# Altium project Adapter_USB3_to_M2_E.PrjPcb
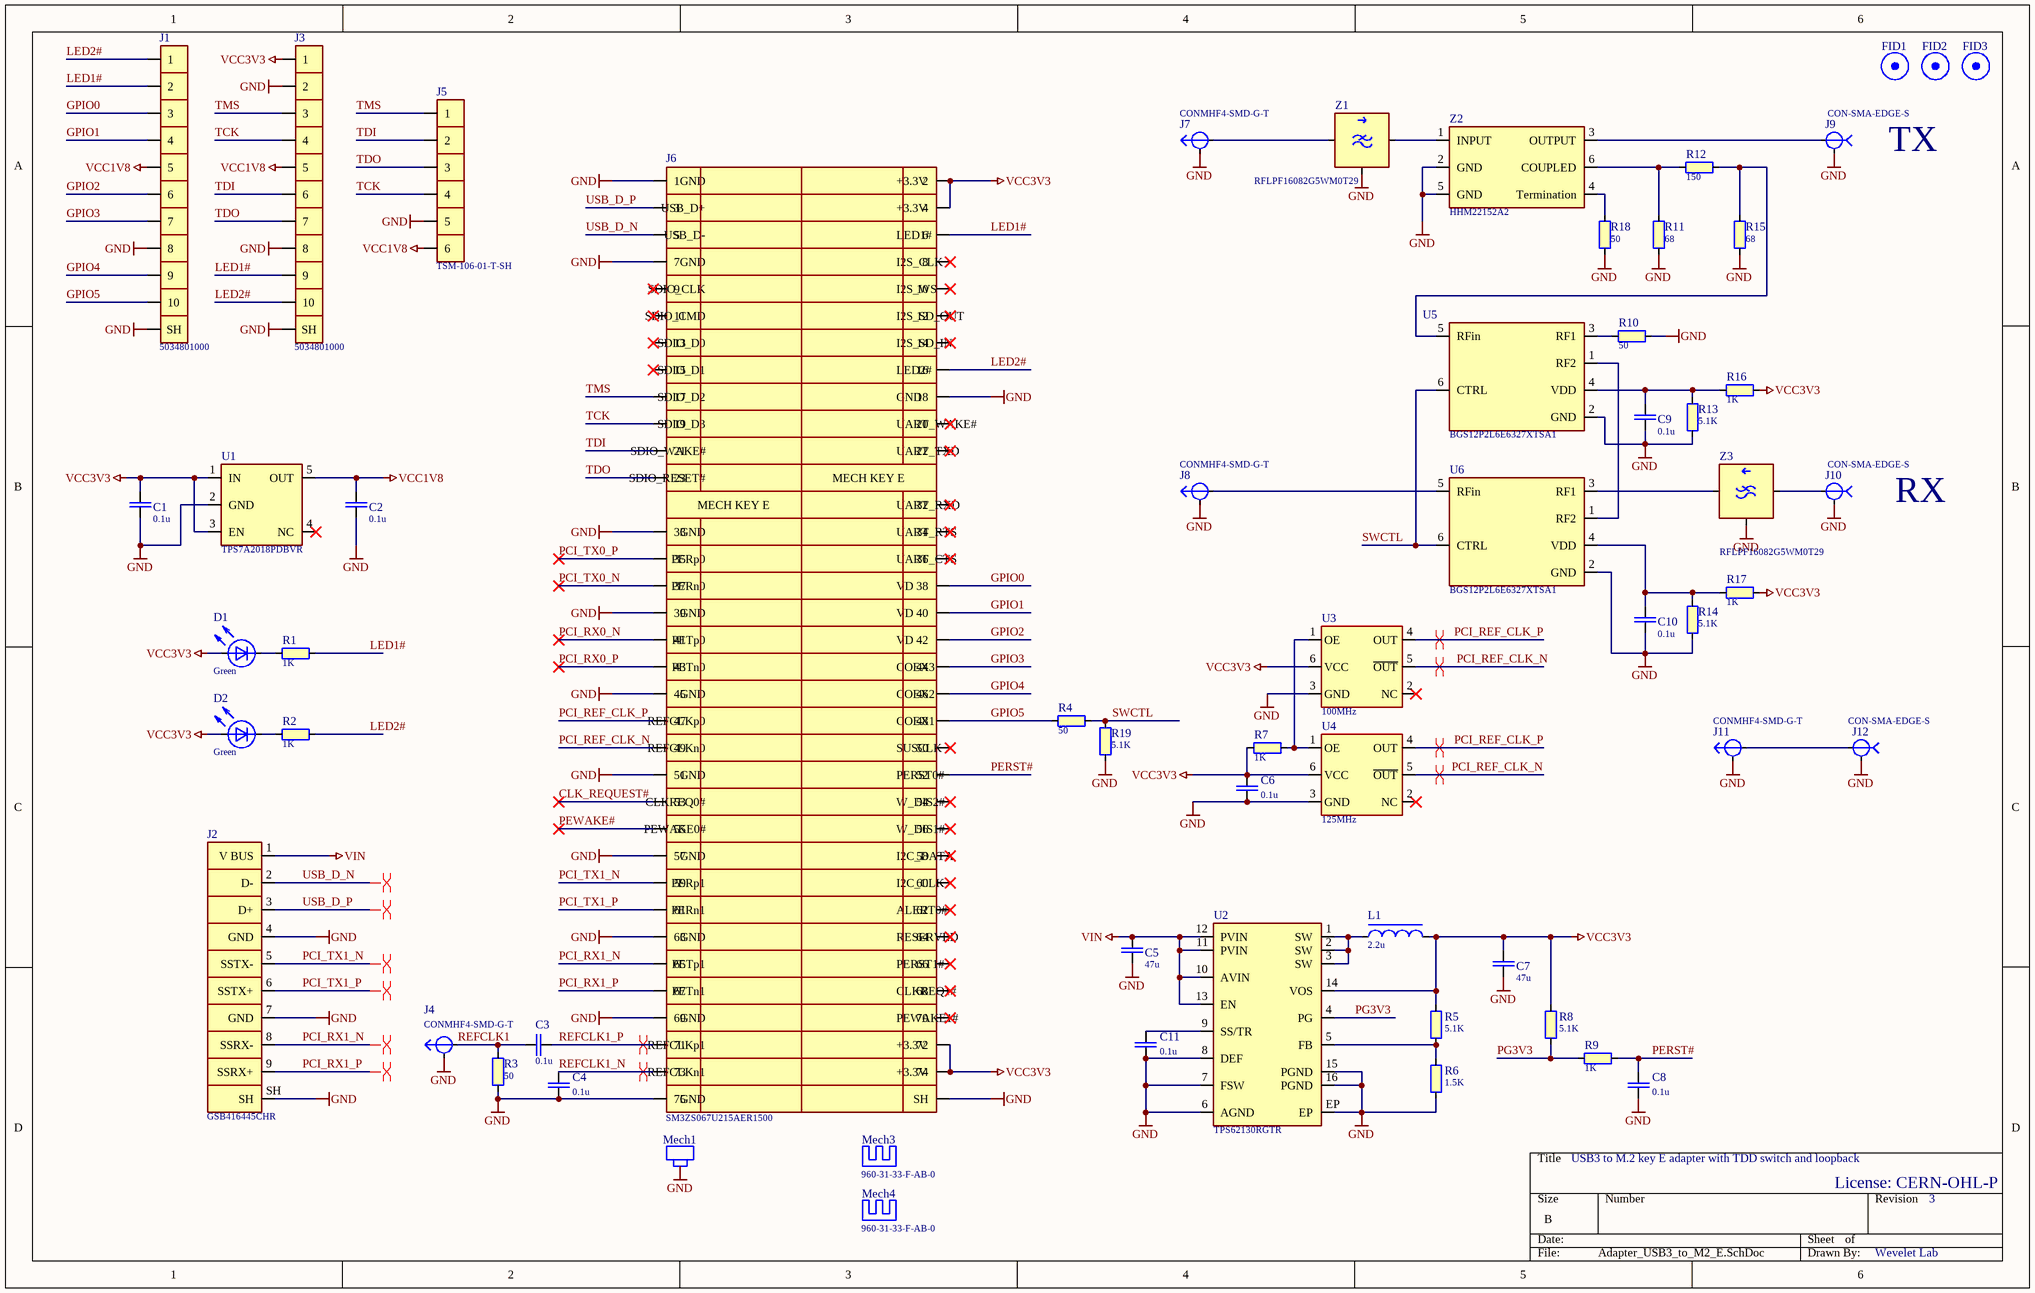
[diagram p0: Adapter_USB3_to_M2_E.SchDoc]
Revision: REV.0
1 sheet, 60 parts. Net scope: global (net labels, ports and power ports of the same name join across sheets).
Board file: Adapter_USB3_to_M2_E.PcbDoc

## Sheet Adapter_USB3_to_M2_E.SchDoc: USB3 to M.2 key E adapter with TDD switch and loopback
size B

### Parts
C1  value 0.1u  [CAPC100X50X55L25N]  (hidden comment: GRM155R71E104KE14D)
C2  value 0.1u  [CAPC100X50X55L25N]  (hidden comment: GRM155R71E104KE14D)
C3  value 0.1u  [CAPC100X50X55L25N]  (hidden comment: GRM155R71E104KE14D)
C4  value 0.1u  [CAPC100X50X55L25N]  (hidden comment: GRM155R71E104KE14D)
C5  value 47u  [CAPC160X80X100L40N]  (hidden comment: Cap-0603-X5R-6.3V-47u-20%)
C6  value 0.1u  [CAPC100X50X55L25N]  (hidden comment: GRM155R71E104KE14D)  (no BOM)
C7  value 47u  [CAPC160X80X100L40N]  (hidden comment: Cap-0603-X5R-6.3V-47u-20%)
C8  value 0.1u  [CAPC100X50X55L25N]  (hidden comment: GRM155R71E104KE14D)
C9  value 0.1u  [CAPC100X50X55L25N]  (hidden comment: GRM155R71E104KE14D)
C10  value 0.1u  [CAPC100X50X55L25N]  (hidden comment: GRM155R71E104KE14D)
C11  value 0.1u  [CAPC100X50X55L25N]  (hidden comment: GRM155R71E104KE14D)
D1  value Green  [LEDC160X80X80L40N-Green]  (hidden comment: LTST-C190KGKT)
D2  value Green  [LEDC160X80X80L40N-Green]  (hidden comment: LTST-C190KGKT)
FID1  Fiducial  [Fiducial_2D]  (value not drawn)  (no BOM)
FID2  Fiducial  [Fiducial_2D]  (value not drawn)  (no BOM)
FID3  Fiducial  [Fiducial_2D]  (value not drawn)  (no BOM)
J1  5034801000  [MOLEX_5034801000]
J2  GSB416445CHR  [AMPHENOL_GSB416445CHR]
J3  5034801000  [MOLEX_5034801000]
J4  CONMHF4-SMD-G-T  [LINX_CONMHF4-SMD-G-T]
J5  TSM-106-01-T-SH  [SAMTEC_TSM-106-01-T-SH]  (no BOM)
J6  SM3ZS067U215AER1500  [JAE_SM3ZS067U215AER1500]
J7  CONMHF4-SMD-G-T  [LINX_CONMHF4-SMD-G-T]
J8  CONMHF4-SMD-G-T  [LINX_CONMHF4-SMD-G-T]
J9  CON-SMA-EDGE-S  [SSE_S01-SJEDM-11BS00]
J10  CON-SMA-EDGE-S  [SSE_S01-SJEDM-11BS00]
J11  CONMHF4-SMD-G-T  [LINX_CONMHF4-SMD-G-T]
J12  CON-SMA-EDGE-S  [SSE_S01-SJEDM-11BS00]
L1  value 2.2u  [IND_TAIYO_NRS5020]  (hidden comment: NRS5020T2R2NMGJ)
Mech1  SM3ZS067U215-NUT1-R2500  [JAE_SM3ZS067U215-NUT1]  (value not drawn)
Mech3  960-31-33-F-AB-0  [WAKEFIELD_960-31-33-F-AB-0]
Mech4  960-31-33-F-AB-0  [WAKEFIELD_960-31-33-F-AB-0]
R1  value 1K  [RESC100X50X40L20N]  (hidden comment: Res-0402-1K-5%)
R2  value 1K  [RESC100X50X40L20N]  (hidden comment: Res-0402-1K-5%)
R3  value 50  [RESC100X50X40L20N]  (hidden comment: Res-0402-51-5%)
R4  value 50  [RESC100X50X40L20N]  (hidden comment: Res-0402-51-5%)
R5  value 5.1K  [RESC100X50X40L20N]  (hidden comment: Res-0402-5.1K-1%)
R6  value 1.5K  [RESC100X50X40L20N]  (hidden comment: Res-0402-1.5K-1%)
R7  value 1K  [RESC100X50X40L20N]  (hidden comment: Res-0402-1K-5%)  (no BOM)
R8  value 5.1K  [RESC100X50X40L20N]  (hidden comment: Res-0402-5.1K-1%)
R9  value 1K  [RESC100X50X40L20N]  (hidden comment: Res-0402-1K-5%)
R10  value 50  [RESC100X50X40L20N]  (hidden comment: Res-0402-51-5%)
R11  value 68  [RESC100X50X40L20N]  (hidden comment: Res-0402-68-5%)
R12  value 150  [RESC100X50X40L20N]  (hidden comment: Res-0402-150-5%)
R13  value 5.1K  [RESC100X50X40L20N]  (hidden comment: Res-0402-5.1K-1%)
R14  value 5.1K  [RESC100X50X40L20N]  (hidden comment: Res-0402-5.1K-1%)
R15  value 68  [RESC100X50X40L20N]  (hidden comment: Res-0402-68-5%)
R16  value 1K  [RESC100X50X40L20N]  (hidden comment: Res-0402-1K-5%)
R17  value 1K  [RESC100X50X40L20N]  (hidden comment: Res-0402-1K-5%)
R18  value 50  [RESC100X50X40L20N]  (hidden comment: Res-0402-51-5%)
R19  value 5.1K  [RESC100X50X40L20N]  (hidden comment: Res-0402-5.1K-1%)
U1  TPS7A2018PDBVR  [SOT23-5P95_280X145L45X40N]
U2  TPS62130RGTR  [QFN17P50_300X300X100L40X24T170N]
U3  value 100MHz  [ABRACON_AK2A]  (hidden comment: AK2ADDF1-100.000T)  (no BOM)
U4  value 125MHz  [EPCOS_SG3225VAN]  (hidden comment: SG3225VAN 125.000000M-KEGA3)  (no BOM)
U5  BGS12P2L6E6327XTSA1  [PSON6P40_110X70X32L20X20N]
U6  BGS12P2L6E6327XTSA1  [PSON6P40_110X70X32L20X20N]
Z1  RFLPF16082G5WM0T29  [WALSIN_RFLPF16082G5WM0T29]
Z2  HHM22152A2  [TDK_HHM22152A2]
Z3  RFLPF16082G5WM0T29  [WALSIN_RFLPF16082G5WM0T29]

### Nets
GND: C1.1 C2.1 C4.1 C5.2 C6.1 C7.2 C8.1 C9.2 C10.2 C11.1 J1.8 J1.SH J2.4(GND) J2.7(GND) J2.SH J3.2 J3.8 J3.SH J4.SH J5.5 J6.1 J6.7 J6.18 J6.33 J6.39 J6.45 J6.51 J6.57 J6.63 J6.69 J6.75 J6.SH J7.SH J8.SH J9.SH J10.SH J11.SH J12.SH Mech1.SH R3.2 R6.1 R10.2 R11.2 R13.1 R14.1 R15.2 R18.1 R19.1 U1.2(GND) U2.6(AGND) U2.7(FSW) U2.8(DEF) U2.15(PGND) U2.16(PGND) U2.EP U3.3(GND) U4.3(GND) U5.2(GND) U6.2(GND) Z1.2 Z2.2(GND) Z2.5(GND) Z3.2
VCC1V8: C2.2 J1.5 J3.5 J5.6 U1.5(OUT)
VCC3V3: C1.2 C6.2 C7.1 D1.A D2.A J3.1 J6.2 J6.4 J6.72 J6.74 L1.2 R5.2 R7.2 R8.2 R16.2 R17.2 U1.1(IN) U1.3(EN) U2.14(VOS) U3.6(VCC) U4.6(VCC)
VIN: C5.1 J2.1(V_BUS) U2.10(AVIN) U2.11(PVIN) U2.12(PVIN) U2.13(EN)
CLK_REQUEST#: J6.53
GPIO0: J1.3 J6.38
GPIO1: J1.4 J6.40
GPIO2: J1.6 J6.42
GPIO3: J1.7 J6.44
GPIO4: J1.9 J6.46
GPIO5: J1.10 J6.48 R4.1
LED1#: J1.2 J3.9 J6.6 R1.2
LED2#: J1.1 J3.10 J6.16 R2.2
PCI_REF_CLK_N: J6.49 U3.5(~{OUT}) U4.5(~{OUT})
PCI_REF_CLK_P: J6.47 U3.4(OUT) U4.4(OUT)
PCI_RX0_N: J6.41
PCI_RX0_P: J6.43
PCI_RX1_N: J2.8(SSRX-) J6.65
PCI_RX1_P: J2.9(SSRX+) J6.67
PCI_TX0_N: J6.37
PCI_TX0_P: J6.35
PCI_TX1_N: J2.5(SSTX-) J6.59
PCI_TX1_P: J2.6(SSTX+) J6.61
PERST#: C8.2 J6.52 R9.1
PEWAKE#: J6.55
PG3V3: R8.1 R9.2 U2.4(PG)
REFCLK1: C3.1 J4.1 R3.1
REFCLK1_N: C4.2 J6.73
REFCLK1_P: C3.2 J6.71
SWCTL: R4.2 R19.2 U5.6(CTRL) U6.6(CTRL)
TCK: J3.4 J5.4 J6.19
TDI: J3.6 J5.2 J6.21
TDO: J3.7 J5.3 J6.23
TMS: J3.3 J5.1 J6.17
USB_D_N: J2.2(D-) J6.5
USB_D_P: J2.3(D+) J6.3
NetC9_1: C9.1 R13.2 R16.1 U5.4(VDD)
NetC10_1: C10.1 R14.2 R17.1 U6.4(VDD)
NetC11_2: C11.2 U2.9(SS/TR)
NetD1_C: D1.C R1.1
NetD2_C: D2.C R2.1
NetJ7_1: J7.1 Z1.1
NetJ8_1: J8.1 U6.5(RFin)
NetJ9_1: J9.1 Z2.3(OUTPUT)
NetJ10_1: J10.1 Z3.1
NetJ11_1: J11.1 J12.1
NetL1_1: L1.1 U2.1(SW) U2.2(SW) U2.3(SW)
NetR5_1: R5.1 R6.2 U2.5(FB)
NetR7_1: R7.1 U3.1(OE) U4.1(OE)
NetR10_1: R10.1 U5.3(RF1)
NetR11_1: R11.1 R12.2 Z2.6(COUPLED)
NetR12_1: R12.1 R15.1 U5.5(RFin)
NetR18_2: R18.2 Z2.4(Termination)
NetU5_1: U5.1(RF2) U6.1(RF2)
NetU6_3: U6.3(RF1) Z3.3
NetZ1_3: Z1.3 Z2.1(INPUT)

Not connected (* = marked no-connect by the designer): J6 8* 9* 10* 11* 12* 13* 14* 15* 20* 22* 32* 34* 36* 50* 54* 56* 58* 60* 62* 64* 66* 68* 70*; Mech3 MH; Mech4 MH; U1 4(NC)*; U3 2(NC)*; U4 2(NC)*

### Layout directives
differential pair: PCI_REF_CLK_N, PCI_REF_CLK_P, PCI_RX1_N, PCI_RX1_P, PCI_TX1_N, PCI_TX1_P, REFCLK1_N, REFCLK1_P, USB_D_N, USB_D_P

### Notes on the sheet
- TX
- RX
- USB3 to M.2 key E adapter with TDD switch and loopback
- License: CERN-OHL-P
- 3
- Wevelet Lab
- (in symbol SM3ZS067U215AER1500) GND; +3.3V; USB_D+; USB_D-; LED1#; I2S_CLK; SDIO_CLK; I2S_WS; SDIO_CMD; I2S_SD_OUT; SDIO_D0; I2S_SD_IN; SDIO_D1; LED2#; SDIO_D2; SDIO_D3; UART_WAKE#; SDIO_WAKE#; UART_TXD; SDIO_RESET#; MECH KEY E; UART_RXD; UART_RTS; PERp0; UART_CTS; PERn0; VD; PETp0; PETn0; COEX3; COEX2; REFCLKp0; COEX1; REFCLKn0; SUSCLK; PERST0#; CLKREQ0#; W_DIS2#; PEWAKE0#; W_DIS1#; I2C_DATA; PERp1; I2C_CLK; PERn1; ALERT0#; RESERVED; PETp1; PERST1#; PETn1; CLKREQ1#; PEWAKE1#; REFCLKp1; REFCLKn1

### Library data of the parts
C1-C4 C11 = GRM155R71E104KE14D: Capacitor, 0.1u, 25V, 10%, X7R, 0402; Manufacturer: Murata Electronics
C5 C7 = Cap-0603-X5R-6.3V-47u-20%: Capacitor, 47u, 6.3V, 20%, X5R, 0603
C6 C8-C10 = GRM155R71E104KE14D: Capacitor, 0.1u, 25V, 10%, X7R, 0402
D1 D2 = LTST-C190KGKT: LED Diode, Green, -30/+85, SMD0603; Manufacturer: Lite-On Inc.
J1 J3 = 5034801000: Conn, FFC, 10 pins, 0.5mm, -40/+85, Right, SMD; Manufacturer: Molex; Value: 5034801000
J2 = GSB416445CHR: Conn, USB3.2 type A, -30/+85, Right, Trough Hole; Manufacturer: Amphenol ICC; Value: GSB416445CHR
J4 J7 J8 J11 = CONMHF4-SMD-G-T: Conn, IPEX MHF4, Male Pin, 50 Ohm, -65/+165, SMD; Manufacturer: Linx Technologies Inc.; Value: CONMHF4-SMD-G-T
J5 = TSM-106-01-T-SH: Conn, Header 6x1, 2.54mm,Right, Trough Hole; Manufacturer: Samtec; Value: TSM-106-01-T-SH
J6 = SM3ZS067U215AER1500: Conn M.2, Key E, -40/+80, SMD; Manufacturer: JAE; Value: SM3ZS067U215AER1500
J9 J10 J12 = S01-SJEDM-11BS00: Conn, Female Pin, 50 Ohm, SMA; Manufacturer: RF Solutions; Value: CON-SMA-EDGE-S
L1 = NRS5020T2R2NMGJ: Inductor, 2.2u, 2,9A, 42mOhm, +/-30%, -25/+125, SMD; Manufacturer: Taiyo Yuden
Mech1 = SM3ZS067U215-NUT1-R2500: Mech, standoff, M2, 0.35 mm; Manufacturer: JAE; Value: SM3ZS067U215-NUT1-R2500
Mech3 Mech4 = 960-31-33-F-AB-0: Mech, Heatsink, 31x33 mm, front, push pins; Manufacturer: Wakefield; Value: 960-31-33-F-AB-0
R1 R2 R7 R9 R16 R17 = Res-0402-1K-5%: Resistor, 1K, 0.063W, 5%, 0402
  R7 R16: Manufacturer: *
R3 R4 R10 R18 = Res-0402-50-5%: Resistor, 50, 0.063W, 5%, 0402
R5 R8 R13 R14 R19 = Res-0402-5.1K-1%: Resistor, 5.1K, 0.063W, 1%, 0402
  R13: Manufacturer: *
R6 = Res-0402-1.5K-1%: Resistor, 1.5K, 0.063W, 1%, 0402
R11 R15 = Res-0402-68-5%: Resistor, 68, 0.063W, 5%, 0402
R12 = Res-0402-150-5%: Resistor, 150, 0.063W, 5%, 0402
U1 = TPS7A2018PDBVR: IC, VolReg, DC/DC, 2.2/5.5V, 1.8V, 0.25A, -40/+125, 4-X2SON; Manufacturer: Texas Instruments; Value: TPS7A2018PDBVR
U2 = TPS62130RGTR: IC, DC/DC, Step-Down, 3-17/0.9-6V, 3A, -40/+85, QFN-16; Manufacturer: Texas Instruments; Value: TPS62130RGTR
U3 = AK2ADDF1-100.000T: Oscillators, 100MHz, 2.375/3.63V, 25ppm, -40/+85, SMD; Manufacturer: ABRACON
U4 = SG3225VAN 125.000000M-KEGA3: Oscillators, 125MHz, 2.5/3.3V, 30ppm, -40/+85, SMD; Manufacturer: Diodes Incorporated
U5 U6 = BGS12P2L6E6327XTSA1: IC, RF switch, SPDT, 50Ohm -40/+85, TSLP-6-4; Manufacturer: Infineon Technologies; Value: BGS12P2L6E6327XTSA1
Z1 Z3 = RFLPF16082G5WM0T29: Filter, 50Ohm, 2300-2690MHz, SMD; Manufacturer: Walsin Tech Corp; Value: RFLPF16082G5WM0T29
Z2 = HHM22152A2: Signal Coupler, 450-3800MHz, -40/+105, SMD; Manufacturer: TDK; Value: HHM22152A2
FID1-FID3 = Fiducial: Manufacturer: *; Value: *

## Assembly variants
CS: not fitted C6 J3 J5 Mech3 Mech4 R7 U3 U4